# EAGLE schematic LoRa (EAGLE 9.6.2)
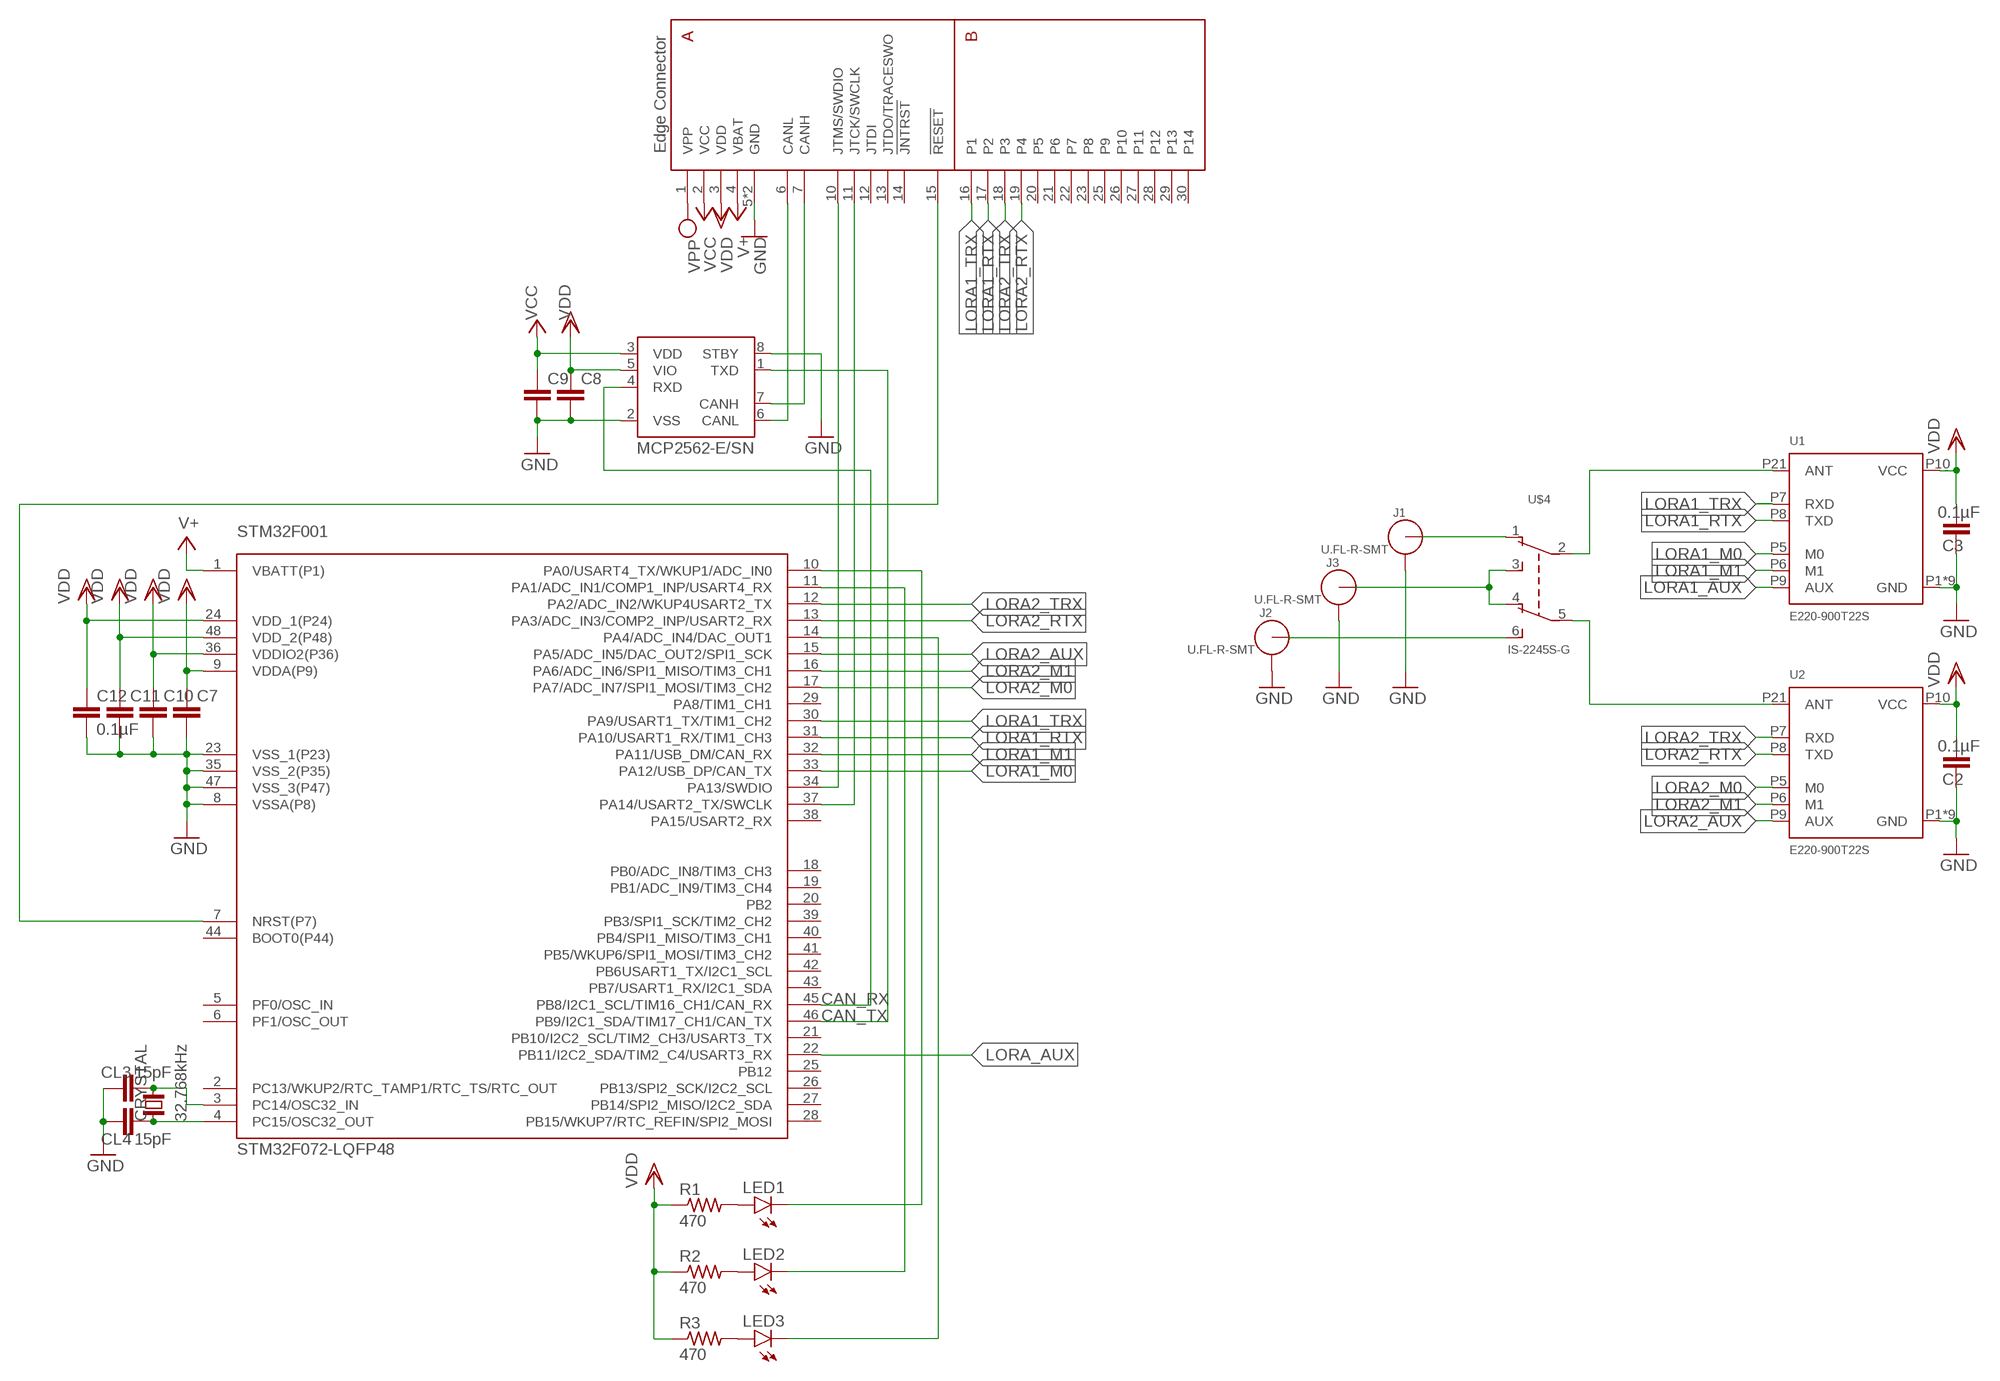
[diagram p0: schematic, sheet 1]

## Parts
C2  0.1µF  C-EUC0603K  [C0603K]
C3  0.1µF  C-EUC0603K  [C0603K]
C7  C-EUC0603K  [C0603K]
C8  C-EUC0603K  [C0603K]
C9  C-EUC0603K  [C0603K]
C10  C-EUC0603K  [C0603K]
C11  C-EUC0603K  [C0603K]
C12  0.1µF  C-EUC0603K  [C0603K]
CL3  15pF  C-EUC0603K  [C0603K]
CL4  15pF  C-EUC0603K  [C0603K]
CRYSTAL  32.768kHz  CRYTALFC-255  [FC-255]
J1  U.FL-R-SMT  [U.FL_SMT]
J2  U.FL-R-SMT  [U.FL_SMT]
J3  U.FL-R-SMT  [U.FL_SMT]
LED1  LEDCHIP-LED0603  [CHIP-LED0603]
LED2  LEDCHIP-LED0603  [CHIP-LED0603]
LED3  LEDCHIP-LED0603  [CHIP-LED0603]
MCP1  MCP2562-E/SN  [SOIC127P600X175-8N]
R1  470  R-US_R0603  [R0603]
R2  470  R-US_R0603  [R0603]
R3  470  R-US_R0603  [R0603]
STM32F001  STM32F072-LQFP48  [LQFP48]
U1  E220-900T22S  [E220-900T22S]
U2  E220-900T22S  [E220-900T22S]
U$2  EDGE30  [EDGE30]
U$4  IS-2245S-G  [IS-2245S-G]

## Nets
CAN_RX: MCP1.4(RXD) STM32F001.45(PB8/I2C1_SCL/TIM16_CH1/CAN_RX)
CAN_TX: MCP1.1(TXD) STM32F001.46(PB9/I2C1_SDA/TIM17_CH1/CAN_TX)
CANH1: MCP1.7(CANH) U$2.7(CANH)
CANL1: MCP1.6(CANL) U$2.6(CANL)
GND: C2.1 C3.1 C7.2 C8.2 C9.2 C10.2 C11.2 C12.2 CL3.1 CL4.1 J1.GND1 J1.GND2 J2.GND1 J2.GND2 J3.GND1 J3.GND2 MCP1.2(VSS) MCP1.8(STBY) STM32F001.8(VSSA(P8)) STM32F001.23(VSS_1(P23)) STM32F001.35(VSS_2(P35)) STM32F001.47(VSS_3(P47)) U1.P1(GND) U1.P2(GND) U1.P3(GND) U1.P4(GND) U1.P11(GND) U1.P13(GND) U1.P19(GND) U1.P20(GND) U1.P22(GND) U2.P1(GND) U2.P2(GND) U2.P3(GND) U2.P4(GND) U2.P11(GND) U2.P13(GND) U2.P19(GND) U2.P20(GND) U2.P22(GND) U$2.5(GND) U$2.8(GND)
LORA1_AUX: U1.P9(AUX)
LORA1_M0: STM32F001.33(PA12/USB_DP/CAN_TX) U1.P5(M0)
LORA1_M1: STM32F001.32(PA11/USB_DM/CAN_RX) U1.P6(M1)
LORA1_RTX: STM32F001.31(PA10/USART1_RX/TIM1_CH3) U1.P8(TXD) U$2.17(P2)
LORA1_TRX: STM32F001.30(PA9/USART1_TX/TIM1_CH2) U1.P7(RXD) U$2.16(P1)
LORA2_AUX: STM32F001.15(PA5/ADC_IN5/DAC_OUT2/SPI1_SCK) U2.P9(AUX)
LORA2_M0: STM32F001.17(PA7/ADC_IN7/SPI1_MOSI/TIM3_CH2) U2.P5(M0)
LORA2_M1: STM32F001.16(PA6/ADC_IN6/SPI1_MISO/TIM3_CH1) U2.P6(M1)
LORA2_RTX: STM32F001.13(PA3/ADC_IN3/COMP2_INP/USART2_RX) U2.P8(TXD) U$2.19(P4)
LORA2_TRX: STM32F001.12(PA2/ADC_IN2/WKUP4USART2_TX) U2.P7(RXD) U$2.18(P3)
LORA_AUX: STM32F001.22(PB11/I2C2_SDA/TIM2_C4/USART3_RX)
N$1: U1.P21(ANT) U$4.2
N$2: U2.P21(ANT) U$4.5
N$4: LED2.A R2.2
N$5: J1.SIG(ANT) U$4.1
N$6: LED3.C STM32F001.14(PA4/ADC_IN4/DAC_OUT1)
N$7: J2.SIG(ANT) U$4.6
N$8: J3.SIG(ANT) U$4.3 U$4.4
N$9: LED3.A R3.2
N$10: LED1.C STM32F001.10(PA0/USART4_TX/WKUP1/ADC_IN0)
N$71: CL4.2 CRYSTAL.1 STM32F001.4(PC15/OSC32_OUT)
N$72: CL3.2 CRYSTAL.2 STM32F001.3(PC14/OSC32_IN)
N$73: LED2.C STM32F001.11(PA1/ADC_IN1/COMP1_INP/USART4_RX)
N$76: LED1.A R1.2
NRST1: STM32F001.7(NRST(P7)) U$2.15(!RESET!)
SWCLK1: STM32F001.37(PA14/USART2_TX/SWCLK) U$2.11(JTCK/SWCLK)
SWDIO1: STM32F001.34(PA13/SWDIO) U$2.10(JTMS/SWDIO)
VBAT: STM32F001.1(VBATT(P1)) U$2.4(VBAT) ; supply symbol labelled V+
VCC: C9.1 MCP1.3(VDD) U$2.2(VCC)
VDD: C2.2 C3.2 C7.1 C8.1 C10.1 C11.1 C12.1 MCP1.5(VIO) R1.1 R2.1 R3.1 STM32F001.9(VDDA(P9)) STM32F001.24(VDD_1(P24)) STM32F001.36(VDDIO2(P36)) STM32F001.48(VDD_2(P48)) U1.P10(VCC) U2.P10(VCC) U$2.3(VDD)
VPP: U$2.1(VPP)
Unconnected: STM32F001.2(PC13/WKUP2/RTC_TAMP1/RTC_TS/RTC_OUT) STM32F001.5(PF0/OSC_IN) STM32F001.6(PF1/OSC_OUT) STM32F001.18(PB0/ADC_IN8/TIM3_CH3) STM32F001.19(PB1/ADC_IN9/TIM3_CH4) STM32F001.20(PB2) STM32F001.21(PB10/I2C2_SCL/TIM2_CH3/USART3_TX) STM32F001.25(PB12) STM32F001.26(PB13/SPI2_SCK/I2C2_SCL) STM32F001.27(PB14/SPI2_MISO/I2C2_SDA) STM32F001.28(PB15/WKUP7/RTC_REFIN/SPI2_MOSI) STM32F001.29(PA8/TIM1_CH1) STM32F001.38(PA15/USART2_RX) STM32F001.39(PB3/SPI1_SCK/TIM2_CH2) STM32F001.40(PB4/SPI1_MISO/TIM3_CH1) STM32F001.41(PB5/WKUP6/SPI1_MOSI/TIM3_CH2) STM32F001.42(PB6USART1_TX/I2C1_SCL) STM32F001.43(PB7/USART1_RX/I2C1_SDA) STM32F001.44(BOOT0(P44)) U$2.12(JTDI) U$2.13(JTDO/TRACESWO) U$2.14(!JNTRST!) U$2.20(P5) U$2.21(P6) U$2.22(P7) U$2.23(P8) U$2.25(P9) U$2.26(P10) U$2.27(P11) U$2.28(P12) U$2.29(P13) U$2.30(P14)

## Library data of the parts
C2 C3 C7-C12 CL3 CL4 = rcl:C-EU: CAPACITOR, European symbol; SPICEPREFIX: C
CRYSTAL = crystal':CRYTAL: CRYSTAL
J1-J3 = connector:U.FL-R-SMT: U.FL-R-SMT Antenna Connector; DIGIKEY: H122041-ND; MANUFACTURER: Hirose; MPN: U.FL-R-SMT-1(01)
LED1-LED3 = led:LED: LED OSRAM: - CHIPLED LG R971, LG N971, LY N971, LG Q971, LY Q971, LO R971, LY R971 LH N974, LH R974 LS Q976, LO Q976, LY Q976 LO Q996 - Hyper CHIPLED LW Q18S LB Q993, LB Q99A, LB R99A - SideLED LS A670, LO A670, LY A670, LG A670, LP A670 LB A673, LV A673, LT A673, LW A673 LH A674 LY A675 LS A676, LA A676, LO A676, LY A676, LW A676 LS A679, LY A679, LG A679 - Hyper Micro SIDELED® LS Y876, LA Y876, LO Y876, LY Y876 LT Y87S - SmartLED LW L88C, LW L88S LB L89C, LB L89S, LG L890 LS L89K, LO L89K, LY L89K LS L896, LA L896, LO L896, LY L896 - TOPLED LS T670, LO T670, LY T670, LG T670, LP T670 LSG T670, LSP T670, LSY T670, LOP T670, LYG T670 LG T671, LOG T671, LSG T671 LB T673, LV T673, LT T673, LW T673 LH T674 LS T676, LA T676, LO T676, LY T676, LB T676, LH T676, LSB T676, LW T676 LB T67C, LV T67C, LT T67C, LS T67K, LO T67K, LY T67K, LW E67C LS E67B, LA E67B, LO E67B, LY E67B, LB E67C, LV E67C, LT E67C LW T67C LS T679, LY T679, LG T679 LS T770, LO T770, LY T770, LG T770, LP T770 LB T773, LV T773, LT T773, LW T773 LH T774 LS E675, LA E675, LY E675, LS T675 LS T776, LA T776, LO T776, LY T776, LB T776 LHGB T686 LT T68C, LB T68C - Hyper Mini TOPLED® LB M676 - Mini TOPLED Santana® LG M470 LS M47K, LO M47K, LY M47K Source: http://www.osram.convergy.de LUXEON: - LUMILED® LXK2-PW12-R00, LXK2-PW12-S00, LXK2-PW14-U00, LXK2-PW14-V00 LXK2-PM12-R00, LXK2-PM12-S00, LXK2-PM14-U00 LXK2-PE12-Q00, LXK2-PE12-R00, LXK2-PE12-S00, LXK2-PE14-T00, LXK2-PE14-U00 LXK2-PB12-K00, LXK2-PB12-L00, LXK2-PB12-M00, LXK2-PB14-N00, LXK2-PB14-P00, LXK2-PB14-Q00 LXK2-PR12-L00, LXK2-PR12-M00, LXK2-PR14-Q00, LXK2-PR14-R00 LXK2-PD12-Q00, LXK2-PD12-R00, LXK2-PD12-S00 LXK2-PH12-R00, LXK2-PH12-S00 LXK2-PL12-P00, LXK2-PL12-Q00, LXK2-PL12-R00 Source: www.luxeon.com KINGBRIGHT: KA-3528ASYC Source: www.kingbright.com
MCP1 = mcp2562-E_SN:MCP2562-E/SN: MCP2562 Series 5 V Surface Mount High-Speed CAN Transceiver - SOIC-8; AVAILABILITY: Unavailable; DESCRIPTION: Microchip MCP2562-E/SN, CAN Transceiver 1MBps 1-channel IEC 61000-4-2, 8-Pin SOIC; MF: Microchip; MP: MCP2562-E/SN; PACKAGE: SO-8 Microchip; PRICE: None
R1-R3 = rcl:R-US_: RESISTOR, American symbol; SPICEPREFIX: R
STM32F001 = stm32f0:STM32F072
U1 U2 = lora:E220-900T22S
U$2 = bus:EDGE30
U$4 = FaBo-Switch:IS-2245S-G